# EAGLE schematic Boost converter (EAGLE 7.2.0)
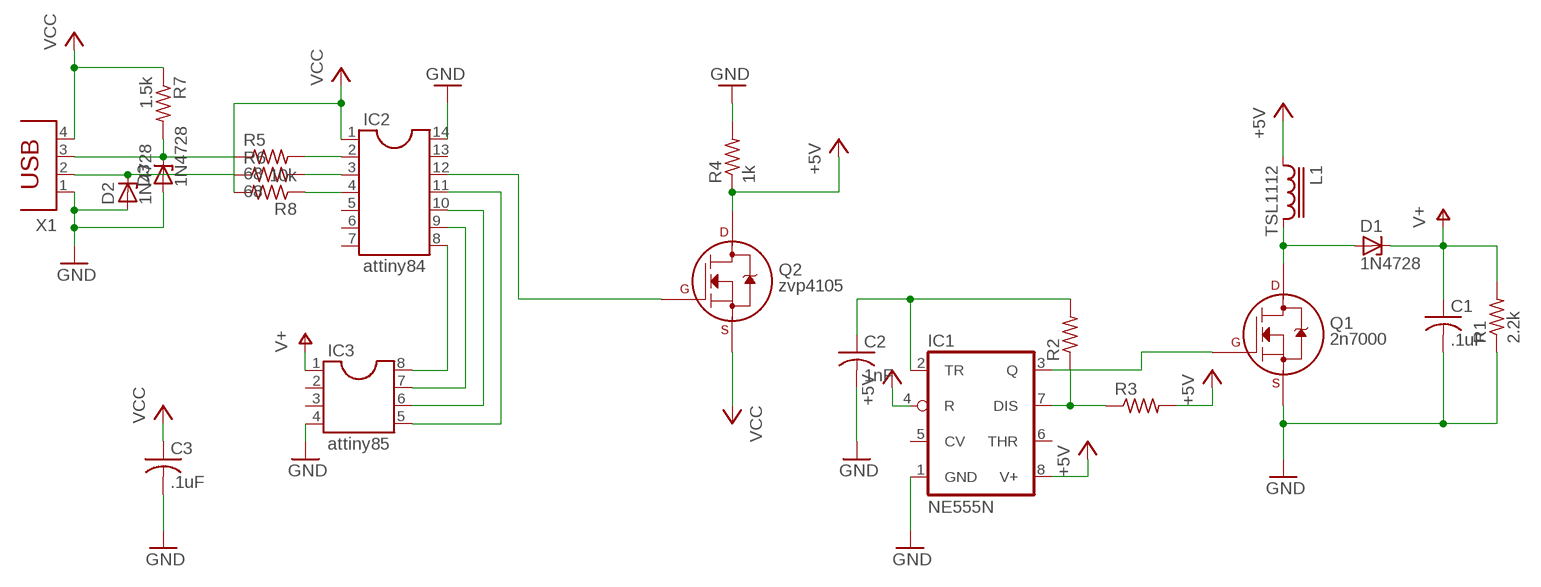
[diagram p0: schematic, sheet 1]

## Parts
C1  .1uF  C-US025-024X044  [C025-024X044]
C2  1nF  C-US025-024X044  [C025-024X044]
C3  .1uF  C-US025-024X044  [C025-024X044]
D1  1N4728  [DO41Z10]
D2  1N4728  [DO41Z10]
D3  1N4728  [DO41Z10]
IC1  NE555N  [DIL08-ROUND]
IC2  attiny84  DIL14  [DIL14]
IC3  attiny85  DIL8S  [SOCKET-08]
L1  TSL1112  [TSL1112]
Q1  2n7000  2N7000_TO92  [TO-92]
Q2  zvp4105  2N7000_TO92  [TO-92]
R1  2.2k  R-US_0204/7  [0204/7]
R2  R-US_0204/7  [0204/7]
R3  R-US_0204/7  [0204/7]
R4  1k  R-US_0204/7  [0204/7]
R5  68  R-US_0204/7  [0204/7]
R6  68  R-US_0204/7  [0204/7]
R7  1.5k  R-US_0204/7  [0204/7]
R8  10k  R-US_0204/7  [0204/7]
X1  PN87520  [PN87520]

## Nets
+5V: IC1.4(R) IC1.8(V+) L1.1 Q2.3(D) R3.2 R4.1
GND: C1.2 C2.2 C3.2 D2.A D3.A IC1.1(GND) IC2.14 IC3.4 Q1.1(S) R1.1 R4.2 X1.1
N$1: IC2.4 R8.1
N$2: D2.C R6.1 X1.2
N$3: D3.C R5.1 R7.2 X1.3
N$4: IC2.2 R5.2
N$5: IC2.3 R6.2
N$6: IC2.8 IC3.8
N$7: IC2.9 IC3.7
N$8: IC2.10 IC3.6
N$9: IC2.11 IC3.5
N$10: IC2.12 Q2.2(G)
N$12: IC1.7(DIS) R2.1 R3.1
N$13: C2.1 IC1.2(TR) R2.2
N$14: IC1.3(Q) Q1.2(G)
N$15: D1.A L1.2 Q1.3(D)
V+: C1.1 D1.C IC3.1 R1.2
VCC: C3.1 IC2.1 Q2.1(S) R7.1 R8.2 X1.4
Unconnected: IC1.5(CV) IC1.6(THR) IC2.5 IC2.6 IC2.7 IC2.13 IC3.2 IC3.3

## Library data of the parts
C1-C3 = resistor:C-US: CAPACITOR, American symbol
D1-D3 = diode:1N4728: Z DIODE 3.3 V, 1W, 5 percent
IC1 = adafruit:*555: TIMER Changed DIP package to have round (not oval) pin pads http://www.ladyada.net/library/pcb/eaglelibrary.html
IC2 = ic-package:DIL14: Dual In Line / Socket
IC3 = ic-package:DIL8: Dual In Line / Socket
L1 = inductors-tdk:TSL1112: POWER INDUCTOR
Q1 Q2 = transistor2:2N700*: 2N7000, 2N7002, NDS7002A N-channel enhancement mode MOSFET
R1-R8 = resistor:R-US_: RESISTOR, American symbol
X1 = con-berg:PN87520: BERG USB connector; OC_FARNELL: unknown; OC_NEWARK: unknown